# EAGLE design SolarMonitorMainBoard (EAGLE 7.5.0)
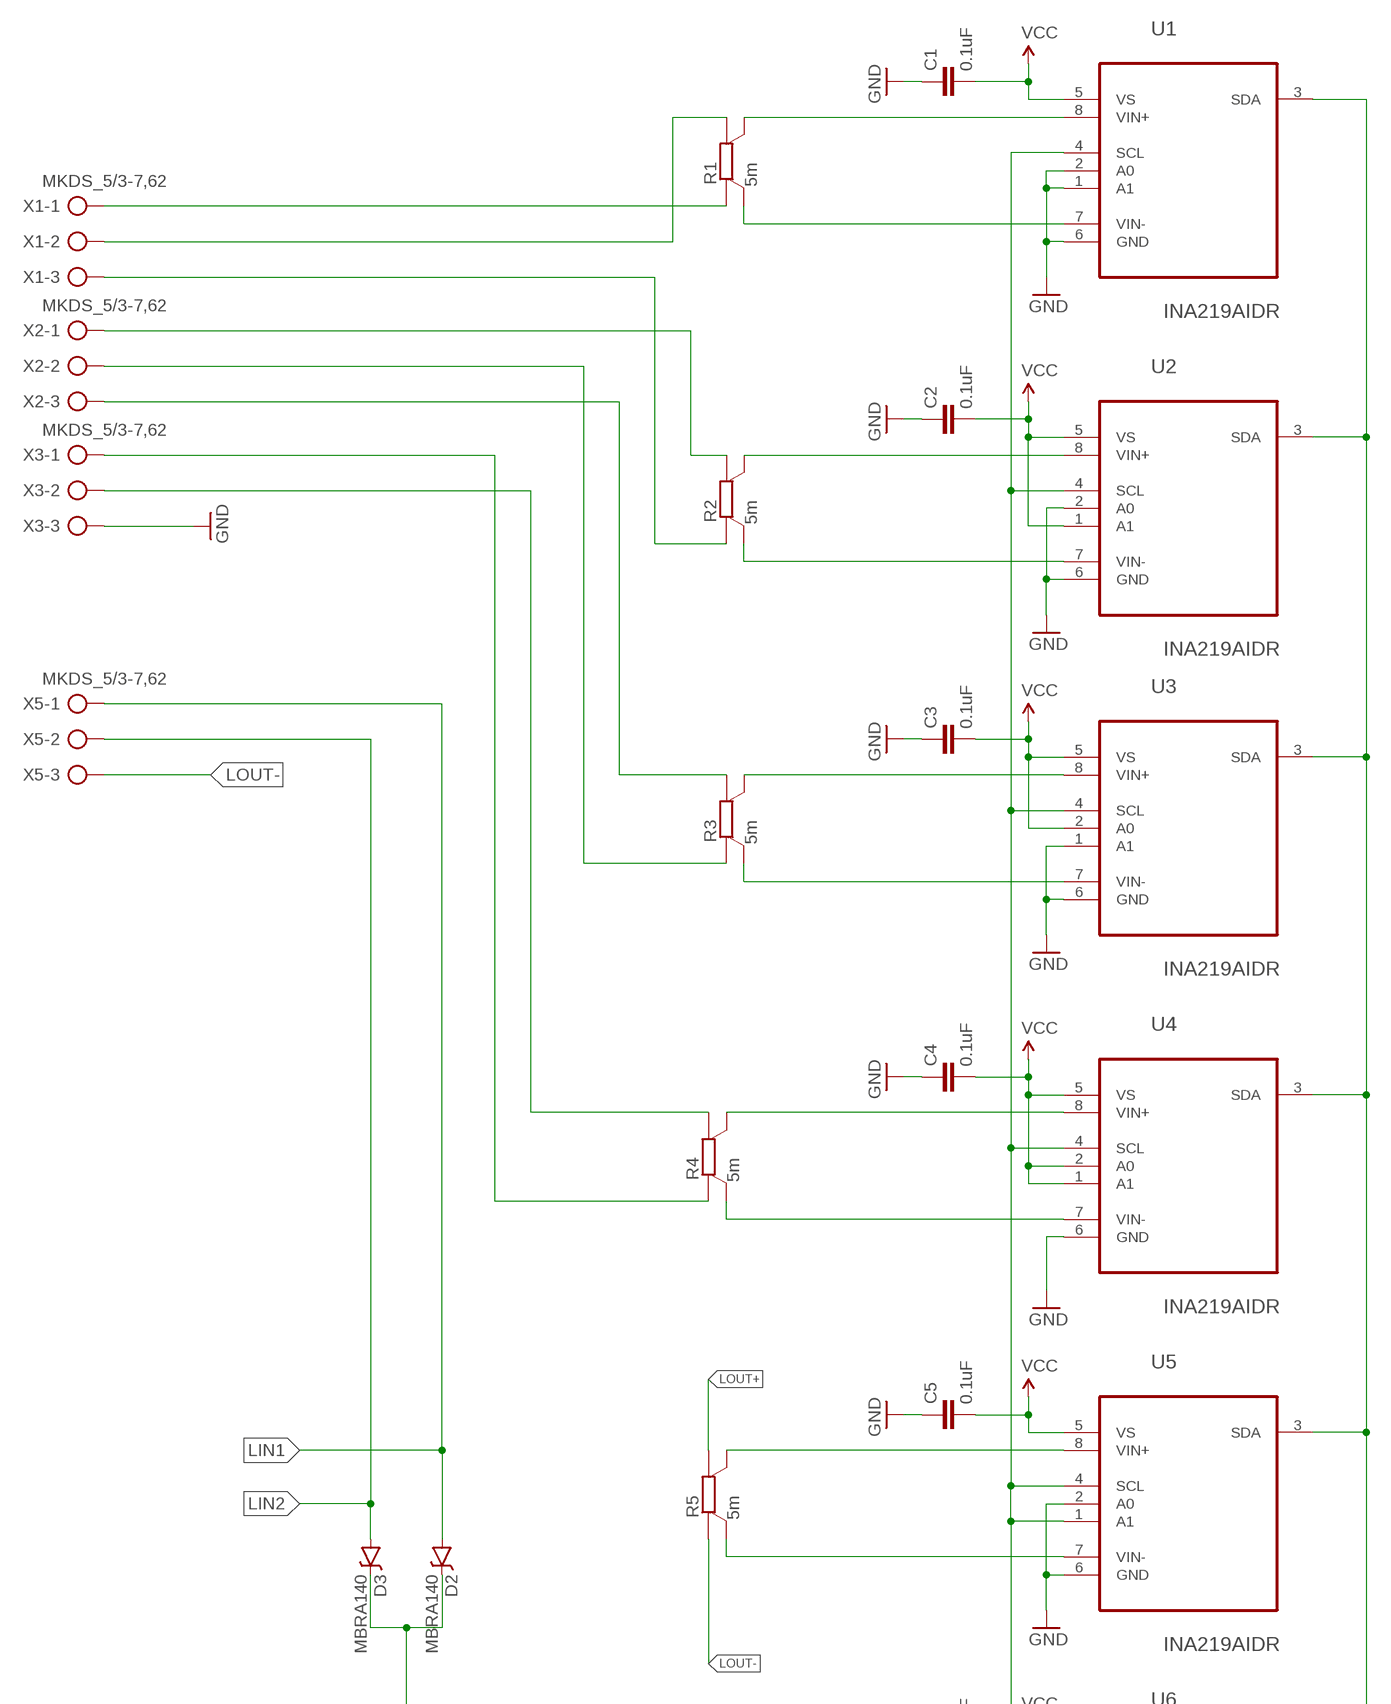
[diagram p0: schematic, sheet 1, part 1 of 3]
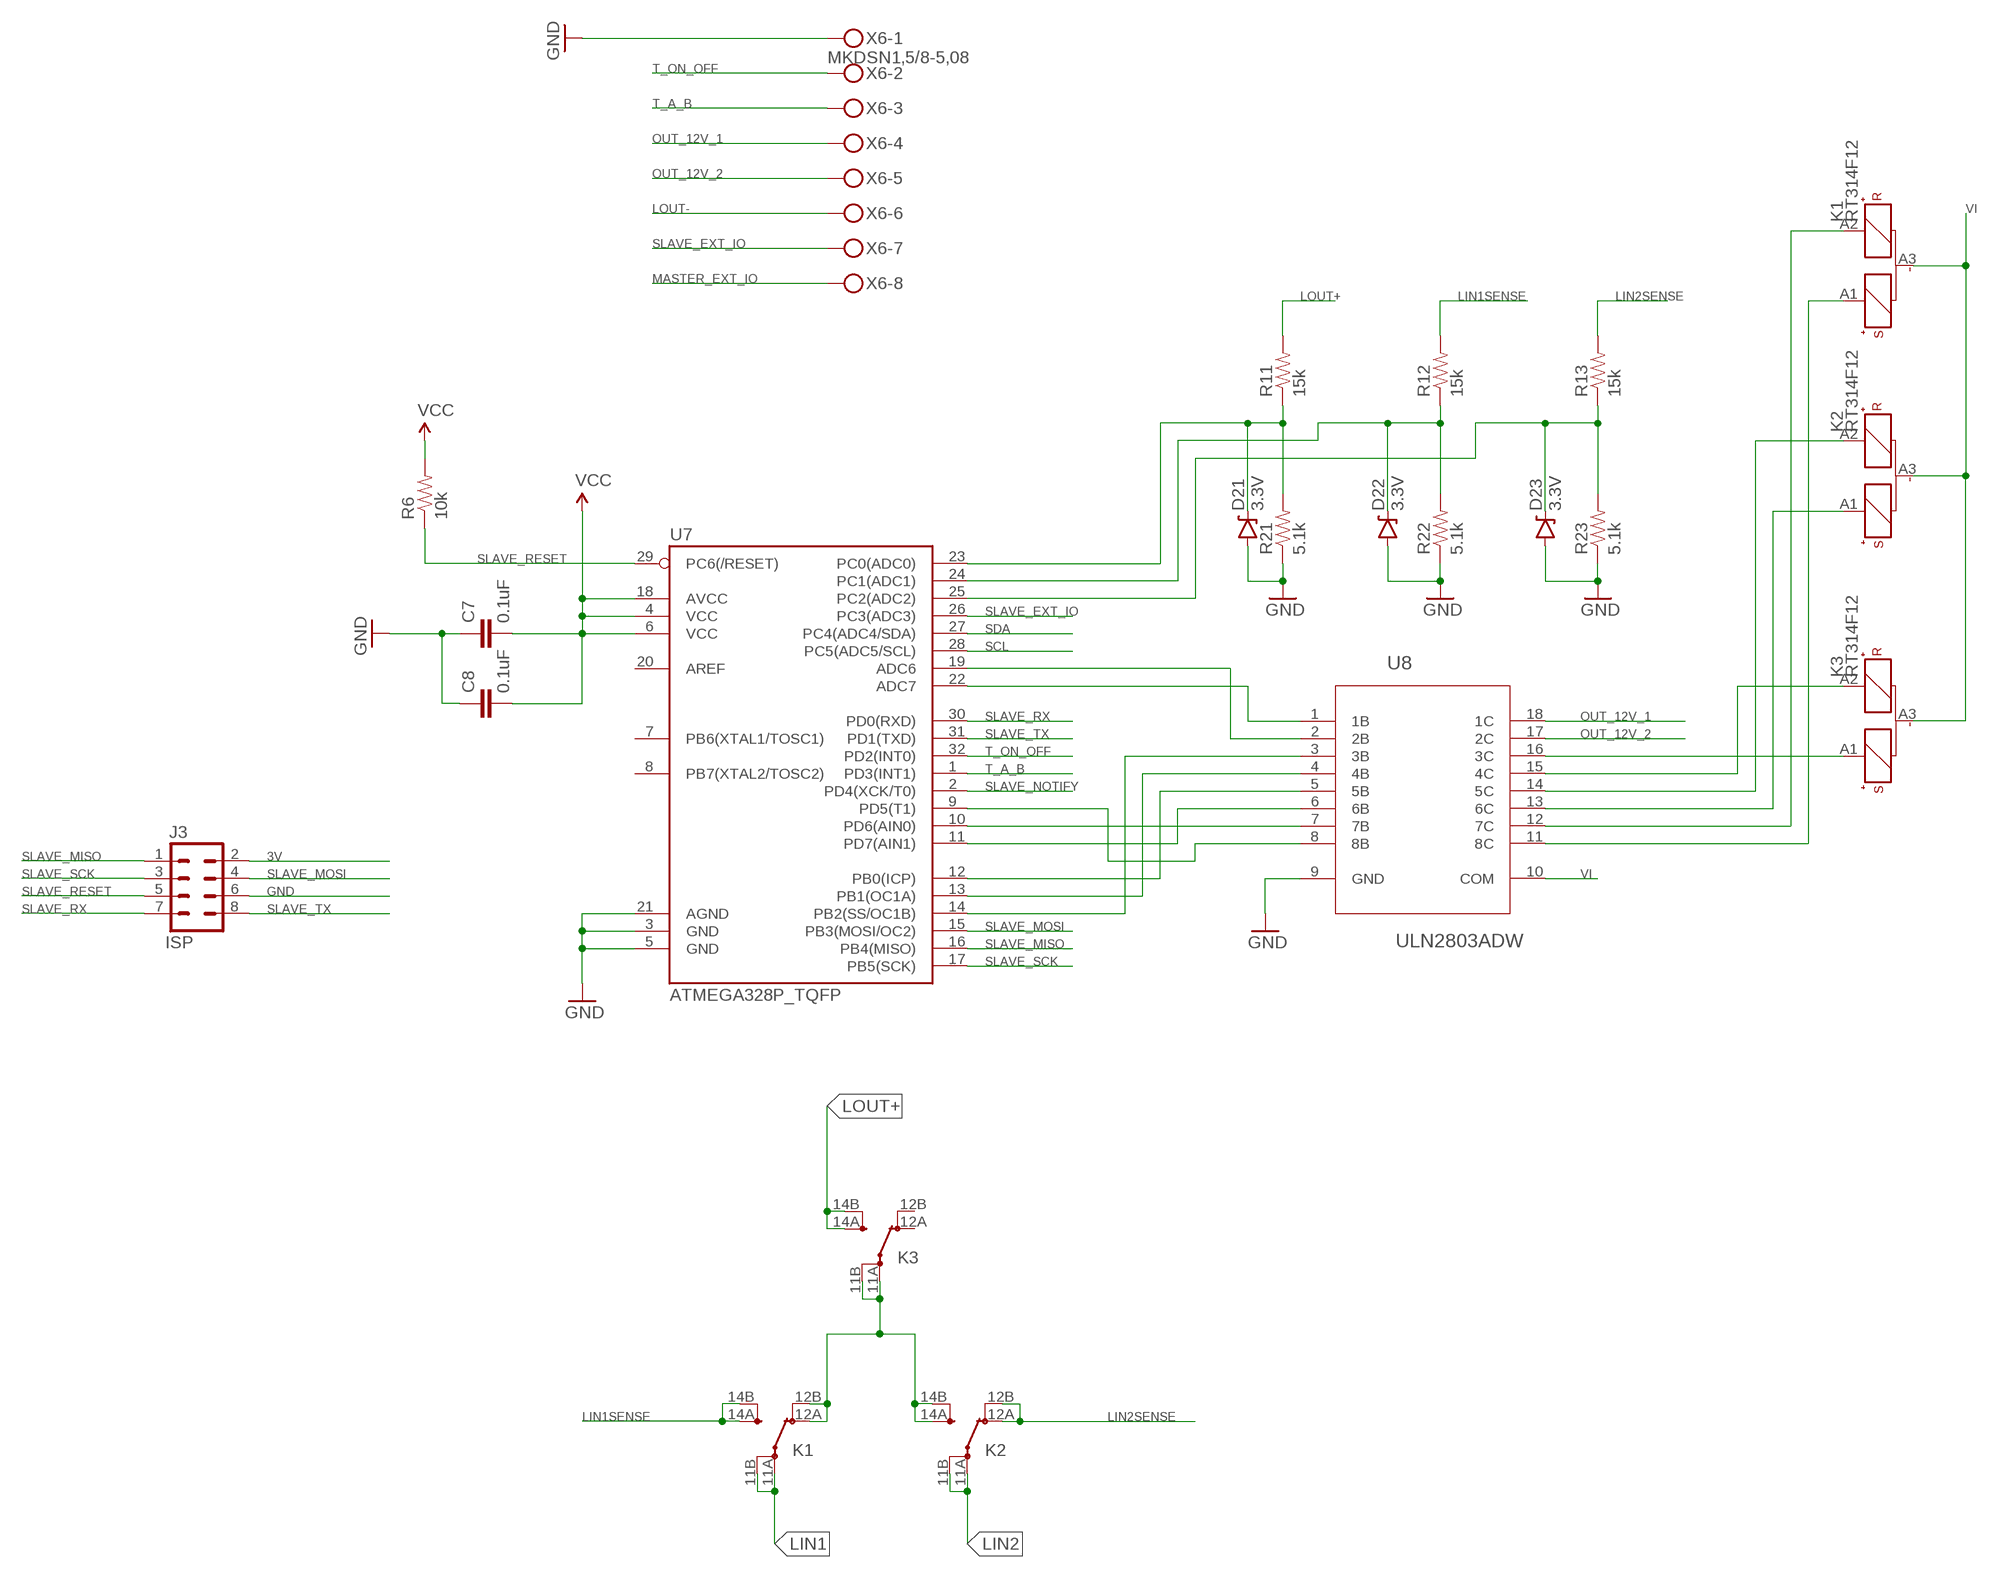
[diagram p1: schematic, sheet 1, part 2 of 3]
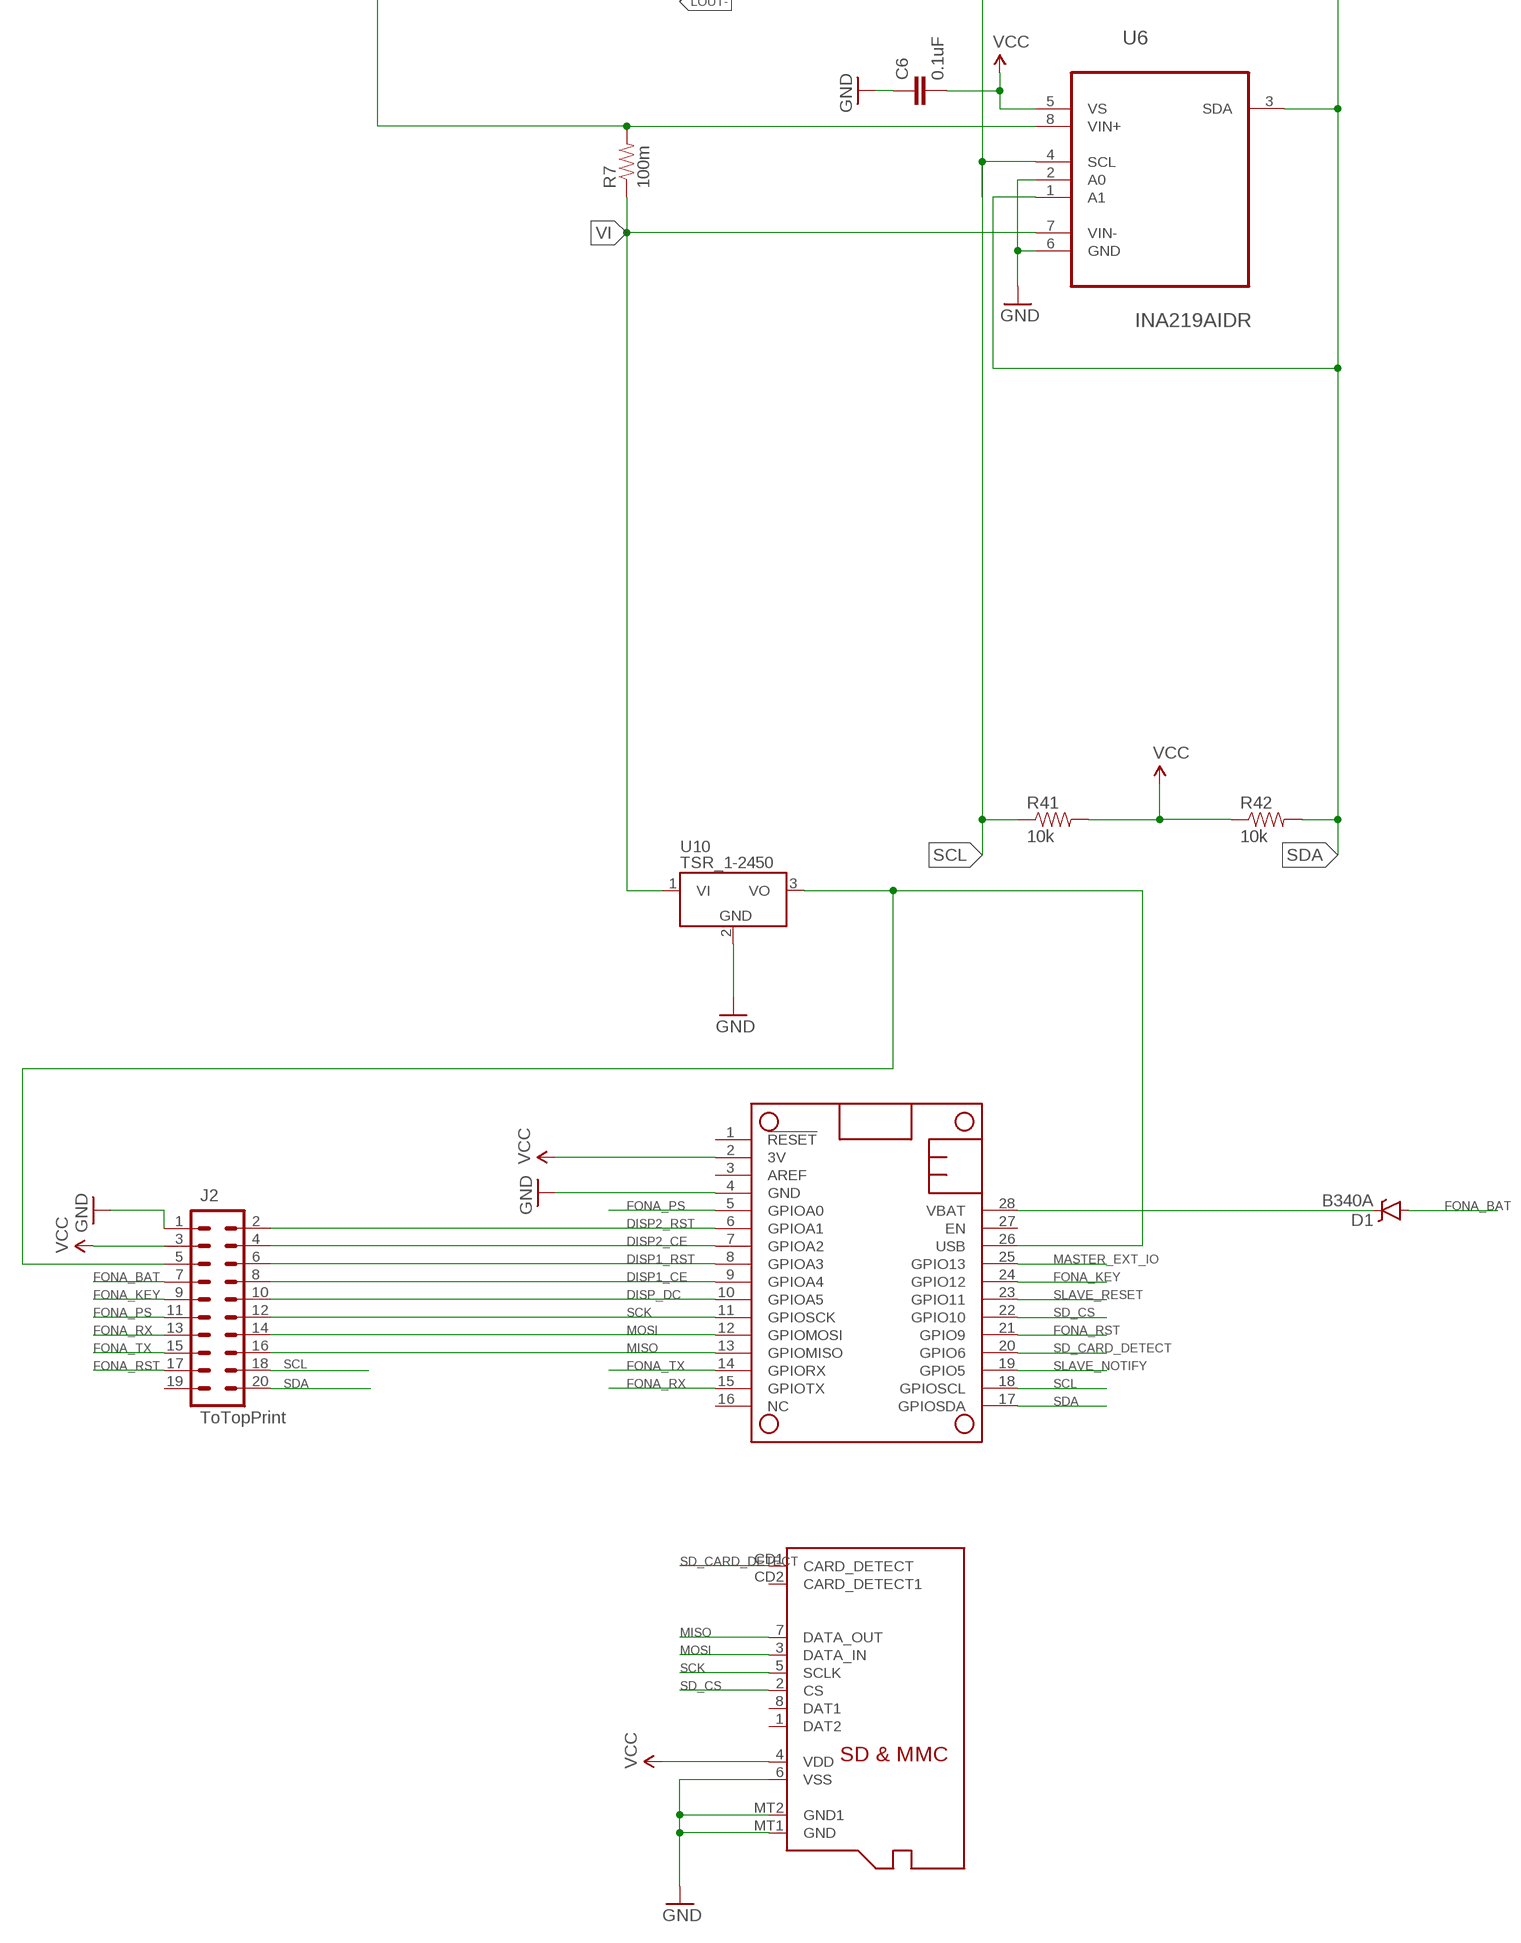
[diagram p2: schematic, sheet 1, part 3 of 3]

## Parts
C1  0.1uF  CAP0805  [0805]
C2  0.1uF  CAP0805  [0805]
C3  0.1uF  CAP0805  [0805]
C4  0.1uF  CAP0805  [0805]
C5  0.1uF  CAP0805  [0805]
C6  0.1uF  CAP0805  [0805]
C7  0.1uF  CAP0805  [0805]
C8  0.1uF  CAP0805  [0805]
D1  B340A  DIODE-SCHOTTKY-B340A  [SMA-DIODE]
D2  MBRA140  DIODE-SCHOTTKY-MBRA140  [SMA-DIODE]
D3  MBRA140  DIODE-SCHOTTKY-MBRA140  [SMA-DIODE]
D21  3.3V  DIODE-ZENER3.3V  [SOD-323]
D22  3.3V  DIODE-ZENER3.3V  [SOD-323]
D23  3.3V  DIODE-ZENER3.3V  [SOD-323]
J2  ToTopPrint  M10X2  [2X10]
J3  ISP  M04X2  [2X4]
K1  RT314F12  [RT1-BI]
K2  RT314F12  [RT1-BI]
K3  RT314F12  [RT1-BI]
MS1  FEATHERWING_NODIM  [FEATHERWING_DIM]
R1  5m  SMV  [SMV]
R2  5m  SMV  [SMV]
R3  5m  SMV  [SMV]
R4  5m  SMV  [SMV]
R5  5m  SMV  [SMV]
R6  10k  RESISTOR0805-RES  [0805]
R7  100m  RESISTOR2512  [R2512]
R11  15k  RESISTOR0805-RES  [0805]
R12  15k  RESISTOR0805-RES  [0805]
R13  15k  RESISTOR0805-RES  [0805]
R21  5.1k  RESISTOR0805-RES  [0805]
R22  5.1k  RESISTOR0805-RES  [0805]
R23  5.1k  RESISTOR0805-RES  [0805]
R41  10k  RESISTOR0805-RES  [0805]
R42  10k  RESISTOR0805-RES  [0805]
U1  INA219AIDR  [SOIC127P600X175-8N]
U2  INA219AIDR  [SOIC127P600X175-8N]
U3  INA219AIDR  [SOIC127P600X175-8N]
U4  INA219AIDR  [SOIC127P600X175-8N]
U5  INA219AIDR  [SOIC127P600X175-8N]
U6  INA219AIDR  [SOIC127P600X175-8N]
U7  ATMEGA328P_TQFP  [TQFP32-08]
U8  ULN2803ADW  [SOIC127P1030X265-18N]
U10  TSR_1-2450  [TSR-1]
U$1  MICROSD  [MICROSD]
X1  MKDS_5/3-7,62  [MKDS_5/3-762]
X2  MKDS_5/3-7,62  [MKDS_5/3-762]
X3  MKDS_5/3-7,62  [MKDS_5/3-762]
X5  MKDS_5/3-7,62  [MKDS_5/3-762]
X6  MKDSN1,5/8-5,08  [MKDSN1,5/8-5,08]

## Nets
1VIN+ [power]: R1.I1(A) X1.2
1VIN- [power]: R1.I2(B) X1.1
3V: C1.2 C2.2 C3.2 C4.2 C5.2 C6.2 C7.2 C8.2 J2.3 J3.2 MS1.2(3V) R6.2 R41.2 R42.1 U1.5(VS) U2.1(A1) U2.5(VS) U3.2(A0) U3.5(VS) U4.1(A1) U4.2(A0) U4.5(VS) U5.5(VS) U6.5(VS) U7.4(VCC) U7.6(VCC) U7.18(AVCC) U$1.4(VDD) ; supply symbol labelled VCC
5V: J2.5 MS1.26(USB) U10.3(VO)
DISP1_CE: J2.8 MS1.9(GPIOA4)
DISP1_RST: J2.6 MS1.8(GPIOA3)
DISP2_CE: J2.4 MS1.7(GPIOA2)
DISP2_RST: J2.2 MS1.6(GPIOA1)
DISP_DC: J2.10 MS1.10(GPIOA5)
FONA_BAT: D1.A J2.7
FONA_KEY: J2.9 MS1.24(GPIO12)
FONA_PS: J2.11 MS1.5(GPIOA0)
FONA_RST: J2.17 MS1.21(GPIO9)
FONA_RX: J2.13 MS1.15(GPIOTX)
FONA_TX: J2.15 MS1.14(GPIORX)
GND: C1.1 C2.1 C3.1 C4.1 C5.1 C6.1 C7.1 C8.1 D21.A D22.A D23.A J2.1 J3.6 MS1.4(GND) R21.1 R22.1 R23.1 U1.1(A1) U1.2(A0) U1.6(GND) U2.2(A0) U2.6(GND) U3.1(A1) U3.6(GND) U4.6(GND) U5.2(A0) U5.6(GND) U6.2(A0) U6.6(GND) U7.3(GND) U7.5(GND) U7.21(AGND) U8.9(GND) U10.2(GND) U$1.6(VSS) U$1.MT1(GND) U$1.MT2(GND1) X3.3 X6.1
LIN1 [power]: D2.A K1.11A(2:PA) K1.11B(2:PB) X5.1
LIN1SENSE: K1.14A(2:SA) K1.14B(2:SB) R12.2
LIN2 [power]: D3.A K2.11A(2:PA) K2.11B(2:PB) X5.2
LIN2SENSE: K2.12A(2:OA) K2.12B(2:OB) R13.2
LOUT+ [power]: K3.14A(2:SA) K3.14B(2:SB) R5.I1(A) R11.2
LOUT- [power]: R5.I2(B) X5.3 X6.6
MASTER_EXT_IO: MS1.25(GPIO13) X6.8
MISO [small]: J2.16 MS1.13(GPIOMISO) U$1.7(DATA_OUT)
MOSI [small]: J2.14 MS1.12(GPIOMOSI) U$1.3(DATA_IN)
N$1 [power]: R2.I2(B) X1.3
N$2: D21.C R11.1 R21.2 U7.23(PC0(ADC0))
N$3: U7.9(PD5(T1)) U8.8(8B)
N$4 [power]: R2.I1(A) X2.1
N$5 [power]: R3.I1(A) X2.3
N$6 [power]: R3.I2(B) X2.2
N$7 [power]: R4.I2(B) X3.1
N$8 [power]: R4.I1(A) X3.2
N$9: D2.C D3.C R7.2 U6.8(VIN+)
N$10: U7.10(PD6(AIN0)) U8.7(7B)
N$11: R2.U1(SA) U2.8(VIN+)
N$12: R2.U2(SB) U2.7(VIN-)
N$13: R1.U1(SA) U1.8(VIN+)
N$14: R1.U2(SB) U1.7(VIN-)
N$15: R3.U1(SA) U3.8(VIN+)
N$16: R3.U2(SB) U3.7(VIN-)
N$17: R4.U1(SA) U4.8(VIN+)
N$18: R4.U2(SB) U4.7(VIN-)
N$19: R5.U1(SA) U5.8(VIN+)
N$20: R5.U2(SB) U5.7(VIN-)
N$21: U7.11(PD7(AIN1)) U8.6(6B)
N$22: K1.12A(2:OA) K1.12B(2:OB) K2.14A(2:SA) K2.14B(2:SB) K3.11A(2:PA) K3.11B(2:PB)
N$23: U7.12(PB0(ICP)) U8.5(5B)
N$24: U7.13(PB1(OC1A)) U8.4(4B)
N$25: U7.14(PB2(SS/OC1B)) U8.3(3B)
N$30: U7.22(ADC7) U8.1(1B)
N$31: U7.19(ADC6) U8.2(2B)
N$32: K2.A1(1:S+) U8.13(6C)
N$33: K2.A2(1:R+) U8.14(5C)
N$38: D22.C R12.1 R22.2 U7.24(PC1(ADC1))
N$40: D23.C R13.1 R23.2 U7.25(PC2(ADC2))
N$42: K3.A2(1:R+) U8.15(4C)
N$43: K1.A2(1:R+) U8.12(7C)
N$45: K1.A1(1:S+) U8.11(8C)
N$47: K3.A1(1:S+) U8.16(3C)
OUT_12V_1: U8.18(1C) X6.4
OUT_12V_2: U8.17(2C) X6.5
SCK [small]: J2.12 MS1.11(GPIOSCK) U$1.5(SCLK)
SCL: J2.18 MS1.18(GPIOSCL) R41.1 U1.4(SCL) U2.4(SCL) U3.4(SCL) U4.4(SCL) U5.1(A1) U5.4(SCL) U6.4(SCL) U7.28(PC5(ADC5/SCL))
SD_CARD_DETECT: MS1.20(GPIO6) U$1.CD1(CARD_DETECT)
SD_CS [small]: MS1.22(GPIO10) U$1.2(CS)
SDA: J2.20 MS1.17(GPIOSDA) R42.2 U1.3(SDA) U2.3(SDA) U3.3(SDA) U4.3(SDA) U5.3(SDA) U6.1(A1) U6.3(SDA) U7.27(PC4(ADC4/SDA))
SLAVE_EXT_IO: U7.26(PC3(ADC3)) X6.7
SLAVE_MISO: J3.1 U7.16(PB4(MISO))
SLAVE_MOSI: J3.4 U7.15(PB3(MOSI/OC2))
SLAVE_NOTIFY: MS1.19(GPIO5) U7.2(PD4(XCK/T0))
SLAVE_RESET: J3.5 MS1.23(GPIO11) R6.1 U7.29(PC6(/RESET))
SLAVE_RX: J3.7 U7.30(PD0(RXD))
SLAVE_SCK: J3.3 U7.17(PB5(SCK))
SLAVE_TX: J3.8 U7.31(PD1(TXD))
T_A_B: U7.1(PD3(INT1)) X6.3
T_ON_OFF: U7.32(PD2(INT0)) X6.2
VBAT: D1.C MS1.28(VBAT)
VI: K1.A3(1:-) K2.A3(1:-) K3.A3(1:-) R7.1 U6.7(VIN-) U8.10(COM) U10.1(VI)
Unconnected: J2.19 K3.12A(2:OA) K3.12B(2:OB) MS1.1(!RESET) MS1.3(AREF) MS1.16(NC) MS1.27(EN) U7.7(PB6(XTAL1/TOSC1)) U7.8(PB7(XTAL2/TOSC2)) U7.20(AREF) U$1.1(DAT2) U$1.8(DAT1) U$1.CD2(CARD_DETECT1)

## Library data of the parts
C1-C8 = SparkFun-Capacitors:CAP: Capacitor Standard 0603 ceramic capacitor, and 0.1" leaded capacitor.
D1 = SparkFun-DiscreteSemi:DIODE-SCHOTTKY: Schottky diodes in SFE's production catalog BAT20J 1A 23V 0.62Vf RB751 120mA 40V 0.37Vf PMEG4005EJ 0.5A 40V 0.42Vf MBRA140 1A 40V 0.5Vf B340A 3A 40V SMA; PROD_ID: DIO-09886
D2 D3 = SparkFun-DiscreteSemi:DIODE-SCHOTTKY: Schottky diodes in SFE's production catalog BAT20J 1A 23V 0.62Vf RB751 120mA 40V 0.37Vf PMEG4005EJ 0.5A 40V 0.42Vf MBRA140 1A 40V 0.5Vf B340A 3A 40V SMA; PROD_ID: DIO-08053
D21-D23 = SparkFun-DiscreteSemi:DIODE-ZENER: Zener Diode Production Part - 8199 3.4V Zener Voltage; PROD_ID: DIO-11284
J2 = SparkFun-Connectors:M10X2: This was SPECIALLY designed to be used with our Graphic LCD Backpack. Be sure you want to use this! It is not only staggered on each line of header holes, but IT IS ALSO offset of the center point of the top and bottom lines by 5 mil. This causes the headers to lock into place on the "standard" footprint on the LCD screen. The extra squares on the tdocu layer are there simply to reference other pins (if you were to actually populate a longer header than ten long - this is what we do with the backpacks).
J3 = SparkFun-Connectors:M04X2: .1" header, two rows of four.
K1-K3 = relay:RT?F*: Power PCB Relay SCHRACK bistable 1 pole 16 A, polarized bistable version Source: http://www.schrack.com/.. 5821.pdf; MPN: RT314F12; OC_FARNELL: unknown; OC_NEWARK: 26M2701
MS1 = BtParts:FEATHERWING
R1-R5 = resistor-shunt:SMV: SMD SHUNT RESISTOR; OC_FARNELL: unknown; OC_NEWARK: unknown
R6 R7 R11-R13 R21-R23 R41 R42 = SparkFun-Resistors:RESISTOR: Resistor Basic schematic elements and footprints for 0603, 1206, and PTH resistors.
U1-U6 = Texas Instruments_By_element14_Batch_1:INA219AIDR: CURRENT/POWER MONITOR; MPN: INA219AIDR; OC_FARNELL: -; OC_NEWARK: 45P7636; PACKAGE: SOIC-8; SUPPLIER: TEXAS INSTRUMENTS
U7 = SparkFun-DigitalIC:ATMEGA328P_TQFP; PROD_ID: IC-09069
U8 = Texas Instruments_By_element14_Batch_1:ULN2803ADW: Darlington transistor array; MPN: ULN2803ADW; OC_FARNELL: 1652419; OC_NEWARK: 69K0711; PACKAGE: SOIC-18; SUPPLIER: TEXAS INSTRUMENTS
U10 = _traco_tsr-1:TSR_1-*: TRACO TSR-1 Series Point-of-Load DC/DC-Converters Vi max. 36 V; Vo = (1.2 .. 15)V ±2%; Io = 0 .. 1 A SIP-Package (drop-in replacement for 78xx linear voltage regulators in TO220-package, vertically assembled) Source: www.tracopower.com Technologies: TSR 1- Vi (V) Vo (V) ±2% Io = 0 .. 1 A 24_ ( generic ) 2412 4.6 .. 36 1.2 2415 4.6 .. 36 1.5 2418 4.6 .. 36 1.8 2425 4.6 .. 36 2.5 2433 4.75.. 36 3.3 2450 6.5 .. 36 5.0 2465 9.0 .. 36 6.5 2490 12 .. 36 9.0 24120 15 .. 36 12 24150 18 .. 36 15 Author: Dipl.-Ing. FH Rainer Bayer HHN Hochschule Heilbronn, rainer.bayer@hs-heilbronn.de Ingenieurbüro ing-rb, mail@ing-rb.de
U$1 = adafruit:MICROSD: Micro-SD / Transflash card holder with SPI pinout For the 3M # 2908-05WB-MG and/or 4UCON #19656 push-push type
X1-X3 X5 = con-phoenix-mkds_5:MKDS_5/3-: MKDS 5/3-6,35 Source: PHOENIX CONTACT; OC_FARNELL: unknown; OC_NEWARK: unknown
X6 = con-phoenix-508:MKDSN1,5/8-5,08: MKDSN 1,5/ 8-5,08 Printklemme Nennstrom: 13,5 A Nennspannung: 250 V Rastermaß: 5,08 mm Polzahl: 8 Anschlussart: Schraubanschluss Montage: Löten Anschlussrichtung Leiter/Platine: 0 ° Artikelnummer: 1729186 Source: http://eshop.phoenixcontact.com .. 1729186.pdf

## Net classes
0 default: width 0.254 mm, drill 0.508 mm, clearance 0.305 mm
1 power: width 3.81 mm, drill 0.076 mm, clearance 1 mm
2 small: width 0.254 mm, drill 0.508 mm, clearance 0.203 mm

## Board
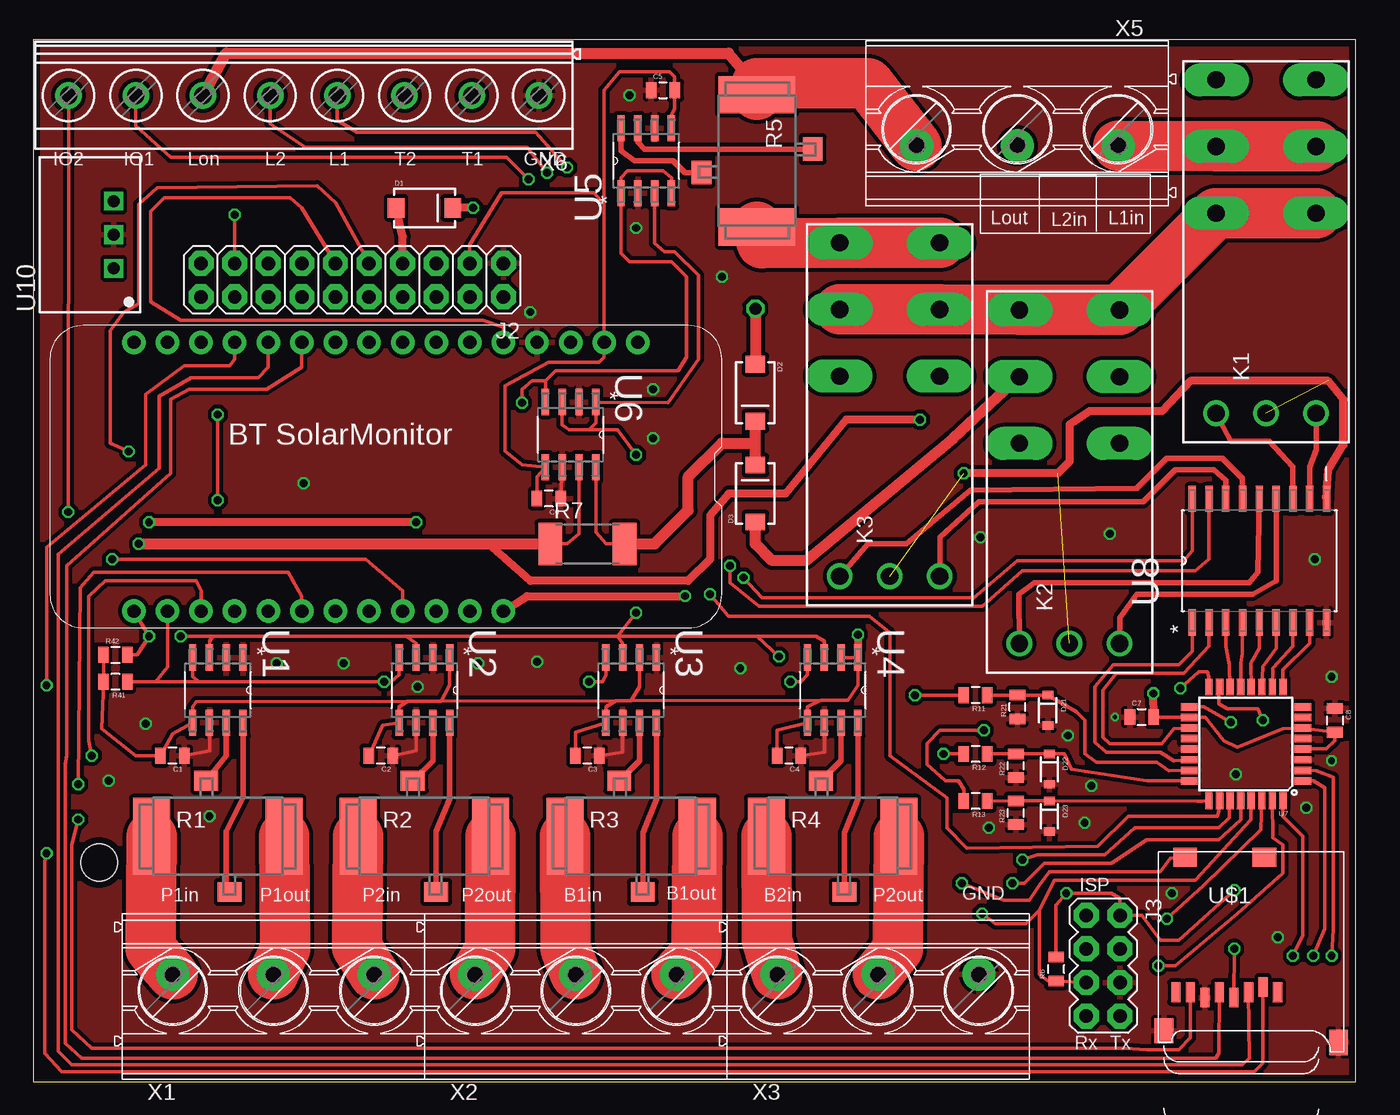
[diagram p3: board, top side]
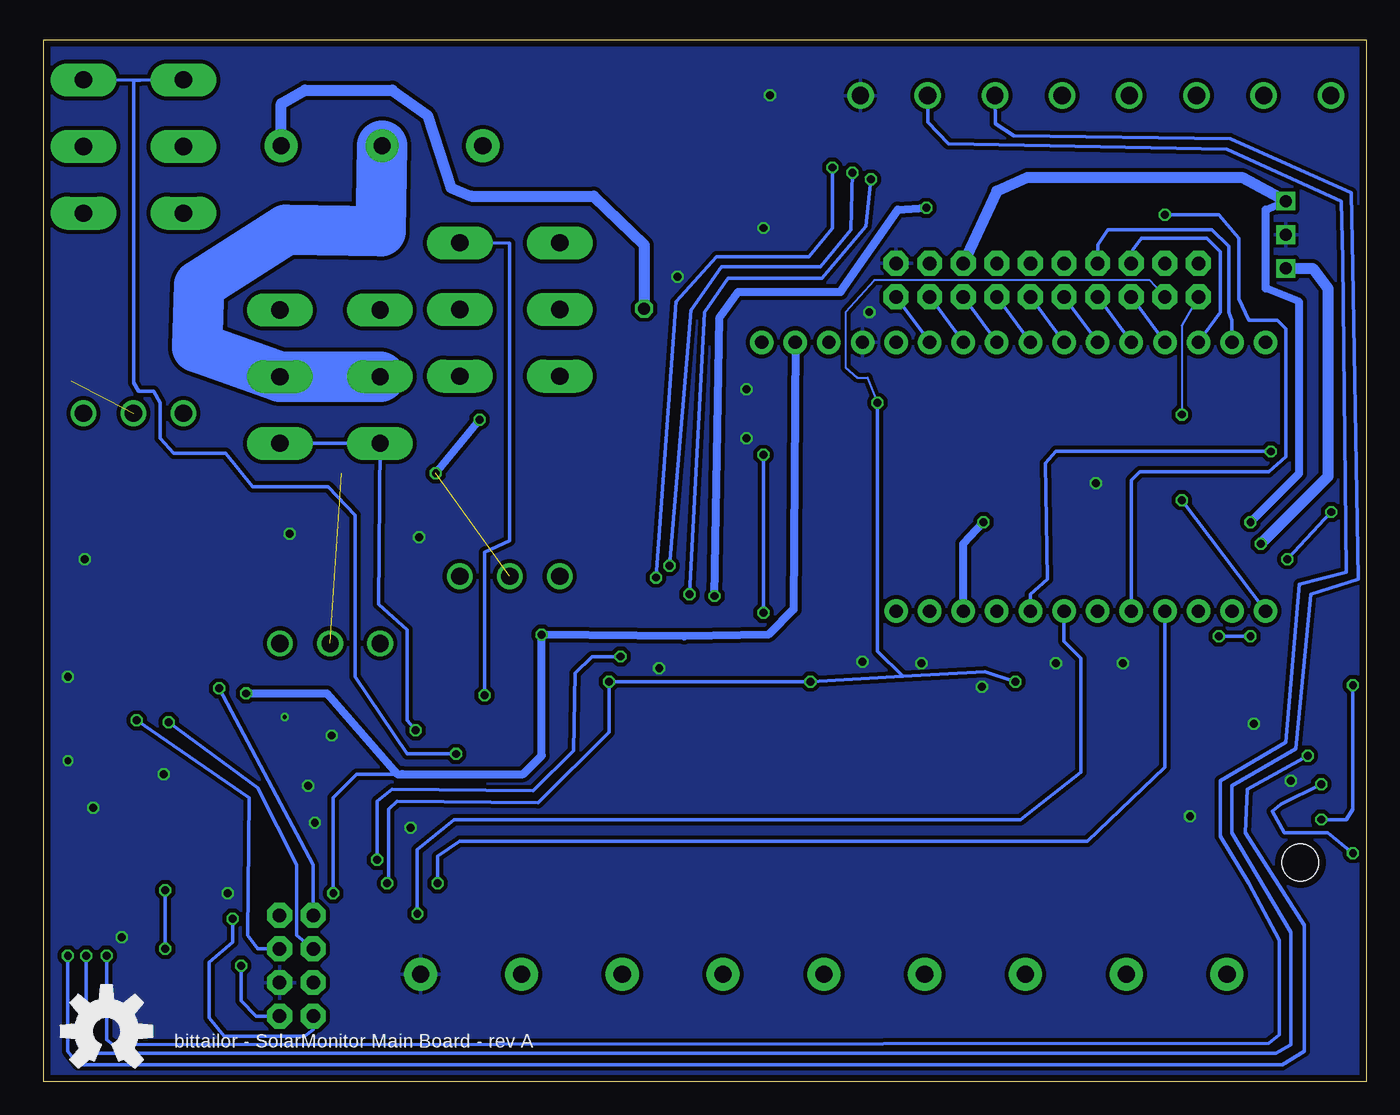
[diagram p4: board, bottom side, seen from below]

Size 100 x 78.73 mm. Coordinates in mm from the lower left corner, seen from the top.
Outline: 0,0 100,0 100,78.73 0,78.73 0,0
Copper layers (1*16): Top 0.035mm / dielectric 1.5mm / Bottom 0.035mm
Design rules "EagleRules_SmartProto": minimum track width 7mil, minimum drill 12mil, track to track 7mil, track to pad 7mil, pad to pad 7mil, via to via 7mil, smd to smd 0mil, copper to edge 20mil, drill to drill 10mil, minimum pad ring 10mil, minimum via ring 6mil, stop-mask expansion 2mil, vias tented up to drill 25mil, thermal gap 10mil
Holes 2.8 mm at 5,16.55

### Footprints (pad centres in the part's own frame; a part is rotated, then mirrored left to right if it is on the bottom)
0805 = smd 0.8 x 1.2: 1 -0.9,0; 2 0.9,0
SMA-DIODE = smd 1.27 x 1.47: A -2.15,0; C 2.15,0
SOD-323 = smd 0.63 x 0.83: A 1.15,0; C -1.15,0
2X10 = drill 1.016 pad 1.88 octagon: 1 -11.43,-1.27; 2 -11.43,1.27; 3 -8.89,-1.27; 4 -8.89,1.27; 5 -6.35,-1.27; 6 -6.35,1.27; 7 -3.81,-1.27; 8 -3.81,1.27; 9 -1.27,-1.27; 10 -1.27,1.27; 11 1.27,-1.27; 12 1.27,1.27; 13 3.81,-1.27; 14 3.81,1.27; 15 6.35,-1.27; 16 6.35,1.27; 17 8.89,-1.27; 18 8.89,1.27; 19 11.43,-1.27; 20 11.43,1.27
2X4 = drill 1.016 pad 1.88 octagon: 1 -3.81,-1.27; 2 -3.81,1.27; 3 -1.27,-1.27; 4 -1.27,1.27; 5 1.27,-1.27; 6 1.27,1.27; 7 3.81,-1.27; 8 3.81,1.27
RT1-BI = drill 1.3 pad 2.5 long: 11A 7.56,3.78; 11B 7.56,-3.78; 12A 2.52,3.78; 12B 2.52,-3.78; 14A 12.6,3.78; 14B 12.6,-3.78 | drill 1.3: A1 -12.6,-3.78; A2 -12.6,3.78; A3 -12.6,0
FEATHERWING_DIM = drill 1 pad 1.778: 1 6.35,1.27; 2 8.89,1.27; 3 11.43,1.27; 4 13.97,1.27; 5 16.51,1.27; 6 19.05,1.27; 7 21.59,1.27; 8 24.13,1.27; 9 26.67,1.27; 10 29.21,1.27; 11 31.75,1.27; 12 34.29,1.27; 13 36.83,1.27; 14 39.37,1.27; 15 41.91,1.27; 16 44.45,1.27; 17 44.45,21.59; 18 41.91,21.59; 19 39.37,21.59; 20 36.83,21.59; 21 34.29,21.59; 22 31.75,21.59; 23 29.21,21.59; 24 26.67,21.59; 25 24.13,21.59; 26 21.59,21.59; 27 19.05,21.59; 28 16.51,21.59
SMV = smd 2.8 x 5.8: I1 5.004,0; I2 -5.004,0 | smd 1.8 x 1.5: U1 0.889,-4.207; U2 -0.889,4.207
R2512 = smd 1.8 x 3.2: 1 -2.8,0; 2 2.8,0
SOIC127P600X175-8N = smd 1.981 x 0.559: 1 -2.464,1.905; 2 -2.464,0.635; 3 -2.464,-0.635; 4 -2.464,-1.905; 5 2.464,-1.905; 6 2.464,-0.635; 7 2.464,0.635; 8 2.464,1.905
TQFP32-08 = smd 1.27 x 0.559: 1 -4.293,2.8; 2 -4.293,2; 3 -4.293,1.2; 4 -4.293,0.4; 5 -4.293,-0.4; 6 -4.293,-1.2; 7 -4.293,-2; 8 -4.293,-2.8; 17 4.293,-2.8; 18 4.293,-2; 19 4.293,-1.2; 20 4.293,-0.4; 21 4.293,0.4; 22 4.293,1.2; 23 4.293,2; 24 4.293,2.8 | smd 0.559 x 1.27: 9 -2.8,-4.293; 10 -2,-4.293; 11 -1.2,-4.293; 12 -0.4,-4.293; 13 0.4,-4.293; 14 1.2,-4.293; 15 2,-4.293; 16 2.8,-4.293; 25 2.8,4.293; 26 2,4.293; 27 1.2,4.293; 28 0.4,4.293; 29 -0.4,4.293; 30 -1.2,4.293; 31 -2,4.293; 32 -2.8,4.293
SOIC127P1030X265-18N = smd 1.981 x 0.559: 1 -4.674,5.08; 2 -4.674,3.81; 3 -4.674,2.54; 4 -4.674,1.27; 5 -4.674,0; 6 -4.674,-1.27; 7 -4.674,-2.54; 8 -4.674,-3.81; 9 -4.674,-5.08; 10 4.674,-5.08; 11 4.674,-3.81; 12 4.674,-2.54; 13 4.674,-1.27; 14 4.674,0; 15 4.674,1.27; 16 4.674,2.54; 17 4.674,3.81; 18 4.674,5.08
TSR-1 = drill 0.9 square: 1 -2.54,0; 2 0,0; 3 2.54,0
MICROSD = smd 0.7 x 1.5: 1 9,-10.64; 2 7.9,-10.24; 3 6.8,-10.64; 4 5.7,-11.04; 5 4.6,-10.64; 6 3.5,-11.04; 7 2.4,-10.64; 8 1.3,-10.64 | smd 1.8 x 1.4: CD1 2,-0.44; CD2 8,-0.44 | smd 1.4 x 1.9: MT1 0.4,-13.54; MT2 13.6,-14.44
MKDS_5/3-762 = drill 1.3 pad 2.5: 1 -7.62,0; 2 0,0; 3 7.62,0
MKDSN1,5/8-5,08 = drill 1.3 pad 2: 1 -17.801,0.025; 2 -12.721,0.025; 3 -7.641,0.025; 4 -2.561,0.025; 5 2.519,0.025; 6 7.599,0.025; 7 12.679,0.025; 8 17.759,0.025

### Placement (x,y rotation side)
C1  10.54,24.64 180 top
C2  26.29,24.64 180 top
C3  41.91,24.64 180 top
C4  57.15,24.64 180 top
C5  47.62,74.93 0 top
C6  38.99,44.07 180 top
C7  83.82,27.56 0 top
C8  98.42,27.3 270 top
D1  29.59,66.04 0 top
D2  54.61,52.07 270 top
D3  54.61,44.45 90 top
D21  76.71,28.07 270 top
D22  76.83,23.62 270 top
D23  76.83,20.07 270 top
J2  24.13,60.58 180 top
J3  80.9,8.76 270 top
K1  93.22,63.12 90 top
K2  78.36,45.72 90 top
K3  64.77,50.8 90 top
MS1  52.07,57.15 180 top
R1  13.97,18.54 0 top
R2  29.59,18.54 0 top
R3  45.21,18.54 0 top
R4  60.45,18.54 0 top
R5  54.74,69.6 270 top
R6  77.34,8.51 90 top
R7  41.91,40.64 0 top
R11  71.25,29.21 180 top
R12  71.25,24.77 180 top
R13  71.25,21.21 180 top
R21  74.42,28.32 90 top
R22  74.3,23.88 90 top
R23  74.3,20.32 90 top
R41  6.22,30.23 180 top
R42  6.22,32.26 0 top
U1  13.97,29.59 270 top
U2  29.59,29.59 270 top
U3  45.21,29.59 270 top
U4  60.45,29.59 270 top
U5  46.35,69.6 90 top
U6  40.64,48.9 270 top
U7  91.69,25.53 180 top
U8  92.71,39.37 90 top
U10  6.1,64.01 90 top
U$1  85.09,17.4 0 top
U$2  [OSHW-LOGO-L]  95.25,3.81 0 bottom
X1  18.16,8.13 0 top
X2  41.02,8.13 0 top
X3  63.88,8.13 0 top
X5  74.42,70.74 180 top
X6  20.45,74.55 180 top

### Tracks (layer width: path | path; a pad name or v marks a point on that pad's centre or on a via)
1VIN+
  Top 3.81: X1.2 19.05,10.03 R1.I1
1VIN-
  Top 3.81: X1.1 8.89,10.03 R1.I2
3V  (via drill 0.6)
  Top 0.254: C2.2 26.42,26.92 U2.5 27.69,28.32 28.32,28.75 | C3.2 41.02,26.42 U3.5 43.31,28.32 44.07,28.79 | C4.2 56.26,26.54 U4.5 58.55,28.32 59.56,28.84 | U4.2 U4.1 | C6.2 38.1,45.72 U6.5 36.96,46.61 35.69,47.62 35.69,52.58 38.99,54.36 42.8,54.36 43.18,54.74 MS1.2 43.18,66.29 | C5.2 | C5.2 48.51,73.53 48.26,73.03 U5.5 | C7.2 U7.18 88.65,27.56 90.04,25.78 91.06,25.27 94.49,26.67 U7.6 C8.2 98.42,25.78 97.79,25.15 97.79,25.16 95.99,25.16 U7.4 | U4.1 62.36,32.64 | 28.32,28.75 12.32,28.7 12.06,28.32 U1.5 10.54,26.29 C1.2 7.75,24.64 5.21,26.67 R41.2 R42.1 | 28.32,28.75 30.86,28.73 | 30.86,28.73 44.07,28.79 | 44.07,28.79 45.21,28.79 | 45.21,28.79 59.56,28.84 | 59.56,28.84 61.59,28.83 62.36,29.97 U4.1 | U2.1 31.5,29.97 30.86,28.73 | U3.2 45.85,29.84 45.21,28.79 | R6.2 77.34,13.34 v78.11,14.22 81.53,14.22 82.17,13.84 J3.2 83.82,12.57 85.22,10.67 86.61,10.67 v90.81,14.48 | v90.81,10.03 U$1.4 | 43.18,66.29 43.18,74.93 44.32,76.33 48.13,76.33 48.51,75.95 C5.2 | J2.3 33.02,63.25 35.43,67.18 42.42,67.18 43.18,66.29
  Top 0.61: v62.36,33.78 62.36,32.64 | C7.2 v84.71,29.34
  Bottom 0.254: v78.11,14.22 78.11,21.46 76.33,23.24 72.9,23.24 | v90.81,14.48 v90.81,10.03
  Bottom 0.61: MS1.2 43.31,35.69 45.21,33.78 51.56,33.66 v62.36,33.78 62.36,24.64 63.75,23.24 72.9,23.24 73.28,23.24 78.61,29.34 v84.71,29.34
5V  (via drill 0.6)
  Top 0.61: v28.96,42.29 v8.76,42.29
  Bottom 0.61: MS1.26 30.48,40.64 v28.96,42.29 | v8.76,42.29 5.08,45.97 5.08,58.93 7.62,59.94 7.62,65.91 U10.3
  Bottom 0.813: U10.3 9.4,68.33 25.65,68.33 27.94,67.31 J2.5
DISP1_CE
  Bottom 0.254: J2.8 MS1.9
DISP1_RST
  Bottom 0.254: J2.6 MS1.8
DISP2_CE
  Bottom 0.254: J2.4 MS1.7
DISP2_RST
  Bottom 0.254: J2.2 MS1.6
DISP_DC
  Bottom 0.254: J2.10 MS1.10
FONA_BAT
  Top 0.61: J2.7 27.94,63.88 D1.A
FONA_KEY  (via drill 0.6)
  Top 0.254: J2.9 22.86,66.42 21.46,67.69 9.4,67.56 8,66.29 8,58.8 6.86,58.17 5.84,56.77 5.84,48.26 v7.24,47.62
  Bottom 0.254: MS1.24 25.4,36.83 24.13,37.97 24.26,46.74 23.5,47.62 v7.24,47.62
FONA_PS
  Top 0.254: J2.11 20.32,66.04 19.43,66.8 9.91,66.8 8.89,65.79 8.89,58.93 11.18,57.53 34.04,57.53 35.56,57.02 MS1.5
FONA_RST  (via drill 0.6)
  Top 0.254: J2.17 v15.24,65.53
  Bottom 0.254: v15.24,65.53 11.18,65.53 9.65,63.75 9.65,59.18 8.89,57.53 6.73,57.53 6.1,56.9 6.1,47.24 7.37,46.1 17.14,46.1 17.78,45.47 MS1.21
FONA_RX
  Bottom 0.254: MS1.15 10.16,57.53 10.41,58.17 10.41,63.12 11.68,64.39 19.56,64.39 20.32,63.25 J2.13
FONA_TX
  Bottom 0.254: MS1.14 11.05,58.17 11.05,62.74 12.06,63.75 17.02,63.75 17.65,62.87 J2.15
GND  (via drill 0.3, 0.5, 0.6)
  Top 0.254: C1.1 13.34,25.02 U1.6 | C2.1 28.96,25.02 U2.6 | C3.1 44.58,24.89 U3.6 | C4.1 59.82,24.89 U4.6 | C6.1 U6.6
  other vias: 18.41,31.62 23.5,31.62 38.1,31.75 33.66,31.62 29.08,29.84 53.47,31.24 8.51,27.05 81.79,27.56 98.17,24.26 94.11,10.92 90.93,23.24 80.01,22.35 13.34,20.07 96.27,20.7 81.41,41.4 71.63,41.15 37.59,58.17 52.07,60.83 46.86,52.32 46.86,48.64 45.59,64.52 45.09,74.55 98.17,30.61 96.9,39.5 78.23,26.16 72.26,19.18 79.5,19.56 5.71,22.73 86.11,14.22 20.45,45.21
  pour Top: -2.54,80.01 -2.54,-2.54 101.6,-2.54 101.6,80.01
  pour Bottom: -1.27,0 -1.27,80.01 101.6,80.01 101.6,-2.54 -1.27,-2.54
LIN1  (via drill 0.9)
  Top 0.813: v54.61,58.42 D2.A
  Top 3.81: X5.1 K1.11A K1.11B
  Bottom 0.813: X5.1 82.04,73.91 80.26,74.93 73.66,74.93 70.99,73.03 69.22,67.56 67.69,66.93 58.42,66.93 54.61,63.25 v54.61,58.42
LIN1SENSE  (via drill 0.6)
  Top 0.254: R12.2 v68.83,24.77
  Bottom 0.254: K1.14A 92.71,75.7 | 92.71,75.7 93.22,75.69 93.22,52.83 92.84,52.2 91.69,52.2 91.19,51.31 91.19,48.64 90.17,47.5 86.23,47.5 84.2,44.96 78.49,44.96 76.45,42.8 76.45,30.61 72.52,24.77 v68.83,24.77 | K1.14B 92.71,75.7
LIN2
  Top 0.813: K2.11A 69.6,48.64 58.42,39.37 55.88,39.37 54.61,40.64 D3.A
  Bottom 3.81: X5.2 74.55,64.26 81.66,64.39 88.27,60.2 88.39,55.5 K2.11B K2.11A
LIN2SENSE  (via drill 0.6)
  Top 0.254: v71.88,26.54 68.58,26.54 67.56,25.53 67.56,24 68.96,22.73 69.98,22.73 70.36,22.1 R13.2
  Bottom 0.254: K2.12B K2.12A 74.68,36.07 72.52,34.16 72.52,27.3 v71.88,26.54
LOUT+  (via drill 0.6)
  Top 0.254: v66.67,29.21 R11.2
  Top 3.81: K3.14B K3.14A 55.12,63.37 R5.I1
  Bottom 0.254: K3.14B 64.77,63.37 64.77,40.89 66.67,40.01 v66.67,29.21
LOUT-
  Top 0.813: X6.6 14.61,77.72 52.58,77.72 54.74,75.18
  Top 3.81: X5.3 63.12,75.44 54.74,75.44 54.74,75.18 R5.I2
MASTER_EXT_IO  (via drill 0.6)
  Top 0.254: MS1.25 27.94,37.08 25.15,39.5 v5.97,39.5 | v2.67,43.05 X6.8
  Bottom 0.254: v5.97,39.5 v2.67,43.05
MISO  (via drill 0.6)
  Top 0.254: U$1.7 87.5,3.3 86.61,2.41 84.2,2.41 82.55,2.54 4.45,2.54 2.92,3.94 2.92,17.91 v3.43,19.81 | MS1.13 15.24,54.61 14.86,54.1 11.43,54.1 8.51,51.94 8.51,46.61 1.02,40.39 v1.02,29.97
  Bottom 0.254: J2.16 MS1.13 | v3.43,19.81 1.52,19.81 1.02,20.57 v1.02,29.97
MOSI
  Top 0.254: U$1.3 91.95,1.78 91.44,1.27 2.92,1.27 1.91,2.29 1.91,39.88 9.53,46.35 9.53,51.82 11.94,53.21 17.02,53.21 17.78,53.98 MS1.12
  Bottom 0.254: J2.14 MS1.12
N$1
  Top 3.81: X1.3 24.51,10.16 R2.I2
N$2
  Top 0.254: R11.1 R21.2 D21.C 78.87,27.94 79.5,27.3 79.5,24.77 80.39,24.13 84.96,24.13 85.85,23.5 U7.23
N$3
  Top 0.254: U7.9 94.49,31.11 96.52,33.15 U8.8
N$4
  Top 3.81: X2.1 34.54,10.03 R2.I1
N$5
  Top 3.81: X2.3 50.16,9.78 R3.I1
N$6
  Top 3.81: X2.2 40.26,10.03 R3.I2
N$7
  Top 3.81: X3.1 55.5,10.67 R4.I2
N$8
  Top 3.81: X3.2 65.41,10.03 R4.I1
N$9
  Top 0.254: U6.8 42.55,41.53 43.31,40.64 R7.2
  Top 0.813: D3.C 54.61,48.26 | 54.61,48.26 D2.C | R7.2 46.99,40.64 49.53,43.18 49.53,45.72 52.07,48.26 54.61,48.26
N$10
  Top 0.254: U7.10 93.73,31.24 95.25,32.89 U8.7
N$11
  Top 0.406: R2.U1 30.48,18.92 31.5,21.34 U2.8
N$12
  Top 0.406: R2.U2 30.23,24.26 U2.7
N$13
  Top 0.406: R1.U1 14.61,14.48 14.61,18.92 15.88,21.46 U1.8
N$14
  Top 0.406: R1.U2 14.61,24.64 U1.7
N$15
  Top 0.406: R3.U1 46.1,18.8 47.12,21.34 U3.8
N$16
  Top 0.406: R3.U2 45.85,24.26 U3.7
N$17
  Top 0.406: R4.U1 61.34,18.8 62.36,21.34 U4.8
N$18
  Top 0.406: R4.U2 61.09,24.26 U4.7
N$19
  Top 0.406: R5.U1 49.28,68.71 48.39,69.6 45.47,69.6 44.45,70.36 U5.8
N$20
  Top 0.406: R5.U2 46.23,70.48 45.72,70.99 U5.7
N$21
  Top 0.254: U7.11 92.96,31.37 93.98,32.77 U8.6
N$22
  Top 3.81: K1.12B K1.12A K2.14B K2.14A K3.11B K3.11A
N$23
  Top 0.254: U7.12 92.08,31.62 92.71,32.77 U8.5
N$24
  Top 0.254: U7.13 91.31,31.62 91.44,32.38 U8.4
N$25
  Top 0.254: U7.14 90.42,31.5 90.17,32.89 U8.3
N$30
  Top 0.254: U7.22 86.23,24.26 85.22,24.89 81.15,24.89 80.26,25.65 80.26,29.84 81.66,31.5 86.61,31.5 87.63,32.51 U8.1
N$31
  Top 0.254: U7.19 86.23,26.67 85.34,25.53 81.41,25.53 80.9,26.04 80.9,29.59 81.92,30.86 87,30.86 88.9,32.89 U8.2
N$32
  Top 0.406: U8.13 93.98,37.85 92.2,36.83 83.44,36.83 82.17,35.05 K2.A1
N$33
  Top 0.406: U8.14 92.58,38.48 91.95,37.72 75.69,37.72 74.55,36.83 K2.A2
N$38
  Top 0.254: R12.1 R22.2 D22.C 77.98,24.77 78.49,23.62 84.2,22.73 85.6,22.73 U7.24
N$40
  Top 0.254: R13.1 R23.2 D23.C 88.01,21.21 88.39,21.21 U7.25
N$42
  Top 0.406: U8.15 91.44,45.59 89.92,47.12 85.72,47.12 83.44,44.83 70.87,44.7 66.04,40.64 63.12,40.64 K3.A2
N$43
  Top 0.406: U8.12 95.25,46.48 93.47,48.39 90.55,48.39 K1.A2
N$45
  Top 0.406: U8.11 96.52,46.48 97.03,47.75 K1.A1
N$47
  Top 0.406: U8.16 90.17,45.47 89.28,46.23 86.36,46.23 83.95,43.81 71.5,43.81 68.58,41.15 K3.A1
OUT_12V_1  (via drill 0.6)
  Top 0.254: U8.18 87.63,40.13 87,39.37 74.42,39.37 71.12,36.58 55.12,36.58 v53.72,38.1 | v40.39,69.09 37.97,71.75 24.51,71.75 22.99,72.64 X6.4
  Bottom 0.254: v53.72,38.1 52.2,58.93 49.15,62.36 42.16,62.36 40.39,64.52 v40.39,69.09
OUT_12V_2  (via drill 0.6)
  Top 0.254: U8.17 88.9,39.5 87.88,38.61 74.8,38.61 71.75,35.94 54.86,35.94 52.7,37.72 v52.7,38.99 | v38.86,68.71 37.34,70.61 20.57,70.61 17.91,72.39 X6.5
  Bottom 0.254: v52.7,38.99 51.05,58.29 48.77,61.59 41.27,61.59 38.99,64.39 v38.86,68.71
SCK
  Top 0.254: U$1.5 89.66,2.16 89.41,1.78 3.68,1.78 2.41,2.92 2.41,24 2.54,24.64 2.54,38.99 10.41,45.97 10.41,51.56 11.81,52.32 17.65,52.32 20.32,53.98 MS1.11
  Bottom 0.254: J2.12 MS1.11
SCL  (via drill 0.6)
  Top 0.254: MS1.18 10.16,31.37 9.27,30.23 | 9.27,30.23 R41.1 | U1.4 12.06,30.61 12.57,30.23 | 12.57,30.23 v26.54,30.23 27.05,30.23 27.69,30.73 U2.4 | 9.27,30.23 12.57,30.23 | U3.4 43.31,30.73 43.05,30.23 v42.04,30.23 | U4.4 58.55,30.73 58.04,30.23 v57.28,30.23 | U7.28 91.31,19.81 89.66,18.29 84.2,18.29 81.53,16.51 76.45,16.51 74.93,14.99 v74.04,14.99 | U6.4 38.73,52.96 | 38.73,52.96 37.72,52.96 36.96,52.32 v36.96,51.31 | 38.73,52.96 39.5,53.72 48.77,53.72 49.4,54.74 49.4,60.83 48.26,61.98 45.09,61.98 44.45,62.61 U5.1 44.45,68.33 44.96,68.83 47.62,68.83 48.26,68.33 U5.4
  Bottom 0.152: J2.18 16.38,60.58 37.21,60.58 39.37,58.17 39.37,53.98 38.48,53.21 37.72,53.21 v36.96,51.31
  Bottom 0.254: 35.06,30.63 v42.04,30.23 v57.28,30.23 57.28,26.42 62.61,21.08 73.28,21.21 73.91,20.57 73.91,14.99 v74.04,14.99 | 35.06,30.63 28.83,30.99 v26.54,30.23 | v36.96,51.31 36.96,32.51 35.06,30.63
SD_CARD_DETECT  (via drill 0.6)
  Top 0.254: U$1.CD1 85.98,16.89 85.22,15.88 76.83,15.88 76.07,14.86 75.31,13.72 73.41,13.72 v70.23,14.99
  Bottom 0.254: v70.23,14.99 70.23,17.02 68.58,18.16 21.08,18.16 15.24,23.75 MS1.20
SD_CS  (via drill 0.6)
  Top 0.254: U$1.2 92.96,1.4 92.33,0.76 2.16,0.76 0.89,2.16 0.89,16.64 v1.02,17.27 | MS1.22 20.32,36.7 19.3,38.48 4.57,38.48 3.56,37.34 v3.43,22.48
  Bottom 0.254: v1.02,17.27 2.92,18.8 6.22,18.8 7.11,20.45 6.48,20.95 v3.43,22.48
SDA  (via drill 0.6)
  Top 0.254: U1.3 13.34,33.27 13.59,33.66 | 13.59,33.66 28.19,33.66 | 28.19,33.66 44.2,33.66 | 44.2,33.66 54.74,33.66 | 54.74,33.66 59.18,33.66 59.82,33.27 U4.3 | U2.3 28.96,33.15 28.19,33.66 | U3.3 44.58,33.15 44.2,33.66 | R42.2 7.87,32.26 v8.76,33.66 MS1.17 | v11.18,33.66 13.59,33.66 | U7.27 90.42,19.94 89.66,19.18 83.31,19.18 81.03,17.14 75.95,17.14 v74.8,16.76 | v56.39,32.13 54.74,33.66 | U5.3 46.99,63.37 47.75,62.74 48.51,62.74 50.29,60.96 50.29,54.61 48.01,51.31 U6.1 42.55,49.78 42.04,49.28 | U6.3 40.01,49.66 40.51,49.28 42.04,49.28 | 44.2,33.66 v45.59,35.43 | v45.59,47.37 44.2,49.28 42.04,49.28 | v13.97,43.94 v13.97,50.42
  Bottom 0.152: J2.20 13.97,57.15 v13.97,50.42
  Bottom 0.254: v8.76,33.66 v11.18,33.66 | v74.8,16.76 74.8,21.21 73.66,22.1 62.99,21.97 59.94,25.02 59.82,30.86 58.55,32.13 v56.39,32.13 | v45.59,35.43 v45.59,47.37 | MS1.17 v13.97,43.94
SLAVE_EXT_IO  (via drill 0.6)
  Top 0.254: U7.26 89.66,20.45 89.53,20.07 82.8,20.07 80.52,17.78 70.61,17.65 69.09,19.18 69.09,21.46 64.77,24.64 64.77,33.91 63.25,35.18 52.58,35.18 v51.18,36.83 | v37.47,68.2 35.81,69.85 10.41,69.85 7.75,72.26 X6.7
  Bottom 0.254: v51.18,36.83 50.04,58.17 48.26,60.71 41.15,60.71 37.85,64.64 v37.47,68.2
SLAVE_MISO  (via drill 0.6)
  Top 0.254: v86.74,29.72 88.14,30.99 88.77,30.99 88.9,30.61 U7.16
  Bottom 0.254: J3.1 79.63,16.38 v86.74,29.72
SLAVE_MOSI  (via drill 0.6)
  Top 0.254: v92.96,27.3 92.58,28.19 90.3,28.19 89.66,28.57 U7.15
  Bottom 0.254: J3.4 83.82,10.03 84.58,11.05 84.45,21.46 v92.96,27.3
SLAVE_NOTIFY  (via drill 0.6)
  Top 0.254: U7.2 97.03,23.5 98.3,22.99 98.3,11.56 v98.17,9.53 | MS1.19 12.7,37.08 12.32,37.85 5.46,37.85 4.19,36.7 4.19,25.78 v4.45,24.64
  Bottom 0.254: v98.17,9.53 98.17,2.29 97.41,1.27 6.35,1.27 4.7,2.29 4.7,11.81 9.14,18.8 9.02,22.1 v4.45,24.64
SLAVE_RESET  (via drill 0.6)
  Top 0.254: U7.29 92.08,19.81 87.88,15.24 77.22,15.24 76.07,12.95 | 76.07,12.95 76.07,8.13 76.71,7.62 R6.1 J3.5 | 76.07,12.95 75.06,11.94 72.77,11.94 v71.75,12.7
  Bottom 0.254: v71.75,12.7 71.75,17.53 68.96,19.81 26.16,19.81 21.59,23.37 21.59,32 22.86,33.27 MS1.23
SLAVE_RX  (via drill 0.6)
  Top 0.254: U7.30 92.84,19.05 88.52,14.86 v85.72,12.32
  Bottom 0.254: v85.72,12.32 85.72,10.54 87.5,9.02 87.5,4.83 86.36,3.43 80.26,3.43 79.63,3.94 J3.7
SLAVE_SCK  (via drill 0.6)
  Top 0.254: U7.17 88.52,28.32 v90.55,27.18
  Bottom 0.254: v90.55,27.18 83.82,22.23 80.9,16.38 80.9,11.05 J3.3
SLAVE_TX  (via drill 0.6)
  Top 0.254: U7.31 93.73,18.41 94.49,17.91 94.49,15.75 91.06,12.7 86.36,8.76 v85.09,8.76
  Bottom 0.254: v85.09,8.76 85.09,6.1 83.95,4.95 J3.8
T_A_B  (via drill 0.6)
  Top 0.254: U7.1 96.77,22.73 97.66,22.23 97.66,11.56 v96.77,9.53
  Bottom 0.254: v96.77,9.53 96.77,2.79 96.01,2.16 6.86,2.16 5.71,2.79 5.71,11.3 10.16,18.8 10.16,22.35 5.33,25.15 4.19,36.83 0.64,37.97 1.02,61.59 1.14,67.18 10.29,71.25 26.67,71.5 28.07,72.39 X6.3
T_ON_OFF  (via drill 0.6)
  Top 0.254: U7.32 94.49,20.07 96.01,18.54 96.01,11.05 v95.25,9.53
  Bottom 0.254: v95.25,9.53 95.25,3.17 94.74,2.79 7.37,2.92 6.6,3.56 6.6,10.67 8.89,14.99 11.05,18.54 11.05,22.73 6.1,25.65 5.08,37.59 1.52,38.48 1.78,62.1 1.91,66.55 10.54,70.48 31.62,70.87 33.15,72.52 X6.2
VBAT  (via drill 0.6)
  Top 0.61: MS1.28 37.34,36.7 v49.28,36.7 | v33.27,66.04 D1.C
  Bottom 0.61: v49.28,36.7 48.9,57.78 47.5,59.69 39.75,59.69 35.43,65.91 v33.27,66.04
VI  (via drill 0.6)  (3 unrouted)
  Top 0.254: R7.1 40.39,40.64 41.27,41.4 U6.7
  Top 0.61: U8.10 97.92,46.23 99.06,48.13 99.06,51.56 97.92,52.96 87.5,52.96 85.34,50.67 79.88,50.67 78.36,49.66 78.36,46.86 77.47,45.97 v70.36,45.97 | v67.06,50.04 61.47,50.04 56.9,44.45 52.58,44.45 51.18,42.8 51.18,39.5 49.53,37.85 37.59,37.85 34.42,40.64
  Top 0.813: v8,40.64 34.42,40.64 R7.1
  Bottom 0.61: v70.36,45.97 v67.06,50.04
  Bottom 0.813: U10.1 4.06,61.47 2.92,59.94 2.92,45.72 v8,40.64

### Text on the board
tPlace: IO2 | IO1 | Lon | L2 | L1 | T2 | T1 | GND | Lout | L2in | L1in | BT SolarMonitor | P1in | P1out | P2in | P2out | B1in | B1out | B2in | P2out | GND | ISP | Rx | Tx
bPlace: bittailor - SolarMonitor Main Board - rev A